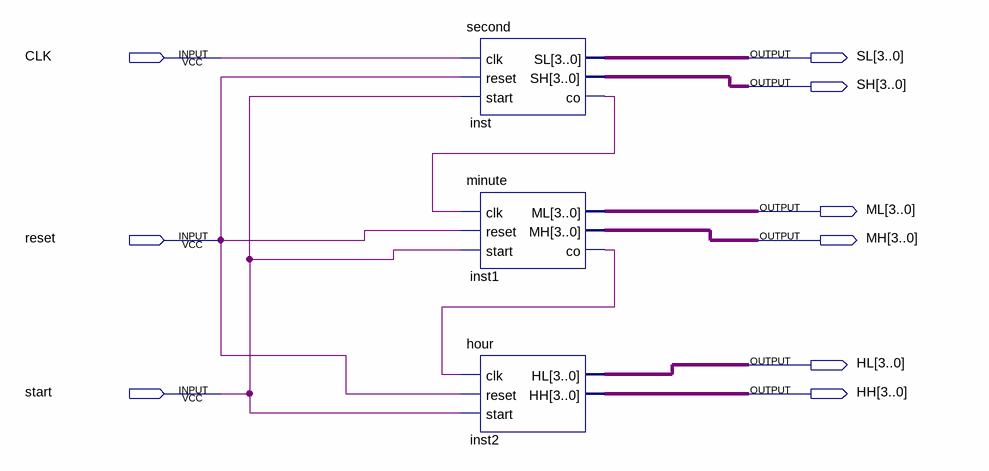
[diagram p0: schematic sheet]
// Quartus schematic Number_Clock.bdf as structural Verilog: 3 symbols, 9 pins
module Number_Clock (
  input  CLK,
  input  reset,
  input  start,
  output [3:0] SL,
  output [3:0] SH,
  output [3:0] ML,
  output [3:0] MH,
  output [3:0] HL,
  output [3:0] HH
);

  wire inst1_co, inst_co;

  second inst (.clk(CLK), .reset(reset), .start(start), .SL(SL), .SH(SH), .co(inst_co));
  minute inst1 (.clk(inst_co), .reset(reset), .start(start), .ML(ML), .MH(MH), .co(inst1_co));
  hour inst2 (.clk(inst1_co), .reset(reset), .start(start), .HL(HL), .HH(HH));
endmodule
